# EAGLE design Full System 2.0 (EAGLE 8.6.0)
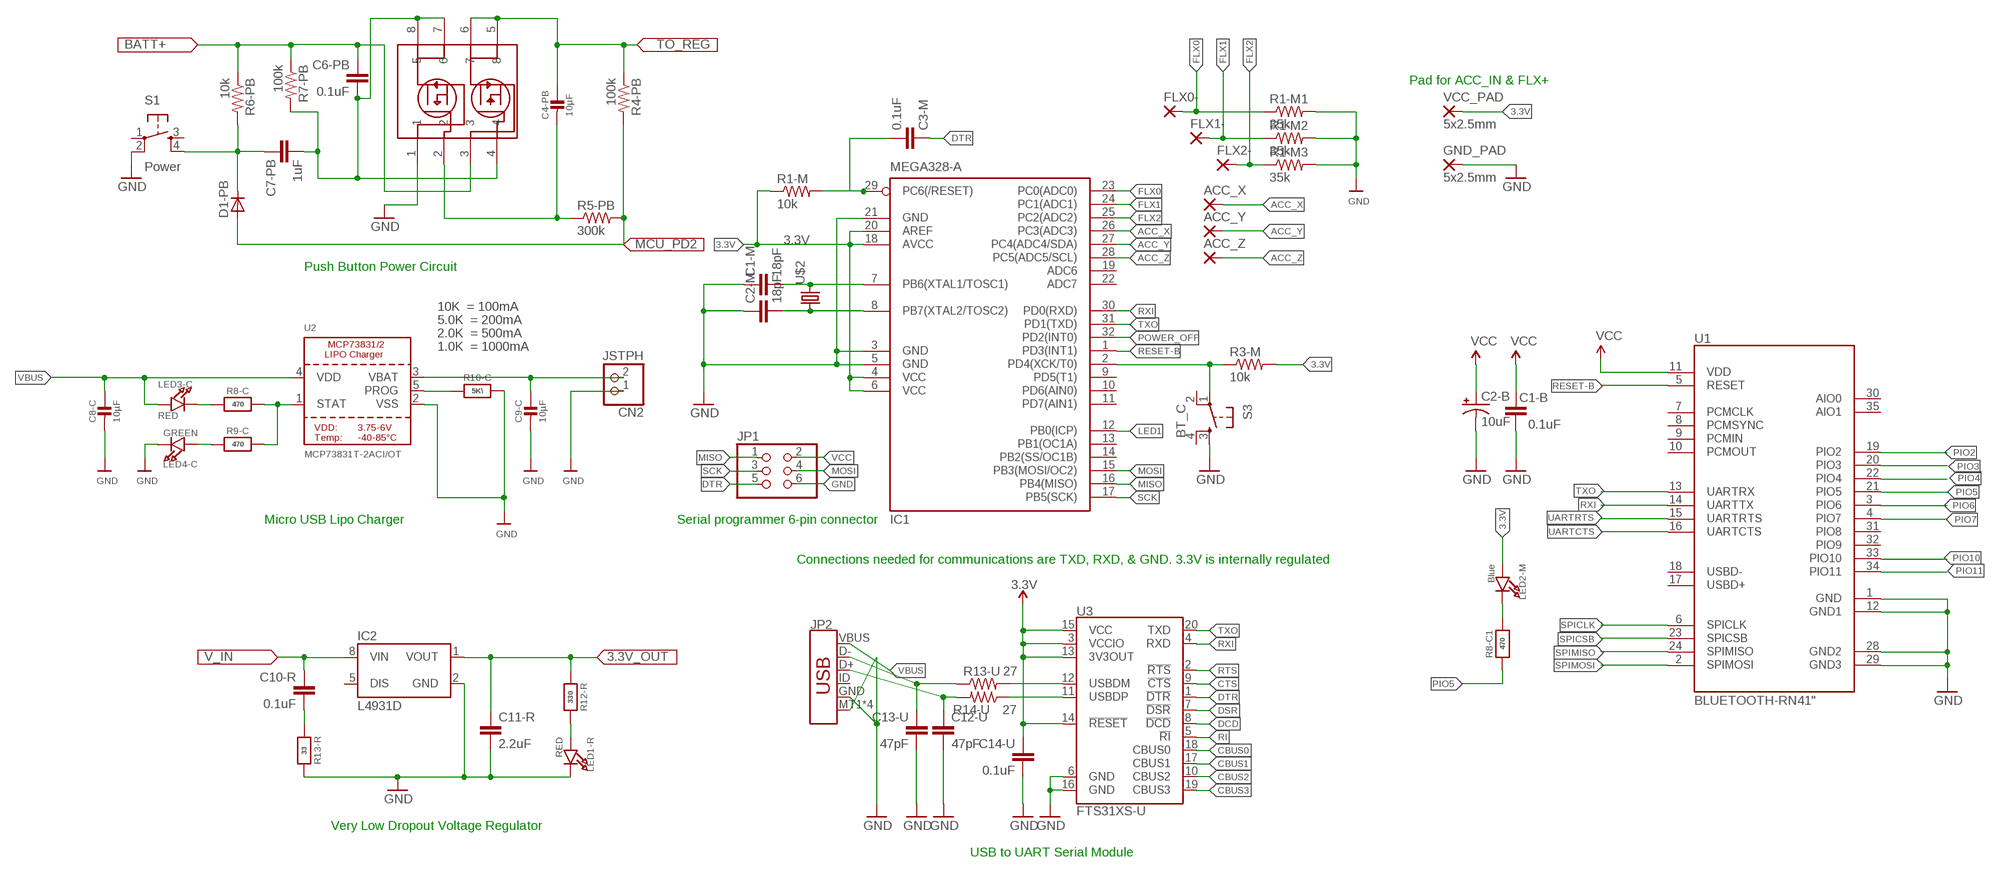
[diagram p0: schematic, sheet 1]

## Parts
ACC_X  1,6/0,8  [1,6/0,8]
ACC_Y  1,6/0,8  [1,6/0,8]
ACC_Z  1,6/0,8  [1,6/0,8]
C1-B  0.1uF  0.1UF-25V(+80/-20%)(0603)  [0603-CAP]
C1-M  18pF  C-EUC0603  [C0603]
C2-B  10uF  CAP_POL1206  [EIA3216]
C2-M  18pF  C-EUC0603  [C0603]
C3-M  0.1uF  0.1UF-25V(+80/-20%)(0603)  [0603-CAP]
C4-PB  10µF  CAP_CERAMIC0805-NOOUTLINE  [0805-NO]
C6-PB  0.1uF  0.1UF-25V(+80/-20%)(0603)  [0603-CAP]
C7-PB  1uF  0.1UF-25V(+80/-20%)(0603)  [0603-CAP]
C8-C  10µF  CAP_CERAMIC0805-NOOUTLINE  [0805-NO]
C9-C  10µF  CAP_CERAMIC0805-NOOUTLINE  [0805-NO]
C10-R  0.1uF  0.1UF-25V(+80/-20%)(0603)  [0603-CAP]
C11-R  2.2uF  0.1UF-25V(+80/-20%)(0603)  [0603-CAP]
C12-U  47pF  47PF-50V-5%(0603)  [0603-CAP]
C13-U  47pF  47PF-50V-5%(0603)  [0603-CAP]
C14-U  0.1uF  0.1UF-25V(+80/-20%)(0603)  [0603-CAP]
CN2  JSTPH  JST_2PIN  [JSTPH2]
D1-PB  D-A1-C3  [SOT23]
FLX0-  1,6/0,8  [1,6/0,8]
FLX1-  1,6/0,8  [1,6/0,8]
FLX2-  1,6/0,8  [1,6/0,8]
GND_PAD  5x2.5mm  WIREPADSMD5-2,5  [5-2,5]
IC1  MEGA328-A  MEGA8-AI  [TQFP32-08]
IC2  L4931D  [SO08]
JP1  PINHD-2X3  [2X03]
JP2  USB_MICRO-B_SMT  [USB-MICROB]
LED1-R  RED  LED0805_NOOUTLINE  [CHIPLED_0805_NOOUTLINE]
LED2-M  Blue  LED0805_NOOUTLINE  [CHIPLED_0805_NOOUTLINE]
LED3-C  RED  LED0805_NOOUTLINE  [CHIPLED_0805_NOOUTLINE]
LED4-C  GREEN  LED0805_NOOUTLINE  [CHIPLED_0805_NOOUTLINE]
R1-M  10k  R-US_R0805  [R0805]
R1-M1  35k  R-US_R0805  [R0805]
R1-M2  35k  R-US_R0805  [R0805]
R1-M3  35k  R-US_R0805  [R0805]
R3-M  10k  R-US_R0805  [R0805]
R4-PB  100k  R-US_R0805  [R0805]
R5-PB  300k  R-US_R0805  [R0805]
R6-PB  10k  R-US_R0805  [R0805]
R7-PB  100k  R-US_R0805  [R0805]
R8-C  470  RESISTOR0805_NOOUTLINE  [0805-NO]
R8-C1  470  RESISTOR0805_NOOUTLINE  [0805-NO]
R9-C  470  RESISTOR0805_NOOUTLINE  [0805-NO]
R10-C  5K\  RESISTOR0805_NOOUTLINE  [0805-NO]
R12-R  330  RESISTOR0805_NOOUTLINE  [0805-NO]
R13-R  33  RESISTOR0805_NOOUTLINE  [0805-NO]
R13-U  27  27OHM1/10W1%(0603)0603-RES  [0603-RES]
R14-U  27  27OHM1/10W1%(0603)0603-RES  [0603-RES]
S1  Power  TAC_SWITCHSMD  [TACTILE_SWITCH_SMD]
S3  BT_C  TAC_SWITCHSMD  [TACTILE_SWITCH_SMD]
U1  BLUETOOTH-RN41"  [RN41]
U2  MCP73831T-2ACI/OT  MCP73831/2  [SOT23-5]
U3  FTS31XS-U  FT231XS  [SSOP20_L]
U$2  CRYSTAL  [CRYSTAL]
U$8  IRF7319PBF  [IRF7319PBF]
VCC_PAD  5x2.5mm  WIREPADSMD5-2,5  [5-2,5]

## Nets
3.3V [power]: C1-B.1 C2-B.A(+) C11-R.1 C14-U.1 IC1.4(VCC) IC1.6(VCC) IC1.18(AVCC) IC1.20(AREF) IC2.1(VOUT) LED2-M.A R1-M.1 R3-M.2 R12-R.1 U1.11(VDD) U3.3(VCCIO) U3.13(3V3OUT) U3.14(!RESET) U3.15(VCC) VCC_PAD.1(P) ; supply symbol labelled VCC
ACC_X: ACC_X.1(P) IC1.26(PC3(ADC3))
ACC_Y: ACC_Y.1(P) IC1.27(PC4(ADC4/SDA))
ACC_Z: ACC_Z.1(P) IC1.28(PC5(ADC5/SCL))
CBUS0: U3.18(CBUS0)
CBUS3: U3.19(CBUS3)
CTS: U3.9(!CTS)
DCD: U3.8(!DCD)
DSR: U3.7(!DSR)
DTR: C3-M.1 JP1.5 U3.1(!DTR)
FLX0: FLX0-.1(P) IC1.23(PC0(ADC0)) R1-M1.1
FLX1: FLX1-.1(P) IC1.24(PC1(ADC1)) R1-M2.1
FLX2: FLX2-.1(P) IC1.25(PC2(ADC2)) R1-M3.1
GND: C1-B.2 C1-M.1 C2-B.C(-) C2-M.1 C8-C.2 C9-C.2 C11-R.2 C12-U.2 C13-U.2 C14-U.2 CN2.1 GND_PAD.1(P) IC1.3(GND) IC1.5(GND) IC1.21(GND) IC2.2(GND) JP1.6 JP2.GND JP2.MT1(SHIELD) JP2.MT2(SHIELD) JP2.P$1(SHIELD) JP2.P$2(SHIELD) LED1-R.C LED4-C.C R1-M1.2 R1-M2.2 R1-M3.2 R10-C.2 R13-R.2 S1.2 S3.3 U1.1(GND) U1.12(GND1) U1.28(GND2) U1.29(GND3) U2.2(VSS) U3.6(GND) U3.16(GND) U$8.1
LED1 [power]: IC1.12(PB0(ICP))
MISO: IC1.16(PB4(MISO)) JP1.1
MOSI: IC1.15(PB3(MOSI/OC2)) JP1.4
N$1: R13-U.2 U3.12(USBDM)
N$2: C1-M.2 IC1.7(PB6(XTAL1/TOSC1)) U$2.P$2
N$3: C2-M.2 IC1.8(PB7(XTAL2/TOSC2)) U$2.P$1
N$4: C6-PB.2 C7-PB.2 R7-PB.2 U$8.4 U$8.7 U$8.8
N$5: C7-PB.1 D1-PB.3(C) R6-PB.2 S1.4
N$6: IC1.2(PD4(XCK/T0)) R3-M.1 S3.1
N$7: LED1-R.A R12-R.2
N$8: C10-R.2 R13-R.1
N$9: C4-PB.2 R5-PB.1 U$8.2
N$10: LED2-M.C R8-C1.2
N$11: R14-U.1 U3.11(USBDP)
N$12: C12-U.1 JP2.D+ R14-U.2
N$16: LED3-C.C R8-C.1
N$17: R8-C.2 R9-C.2 U2.1(STAT)
N$18: R10-C.1 U2.5(PROG)
N$19: LED4-C.A R9-C.1
N$21: C13-U.1 JP2.D- R13-U.1
N$22: U3.17(CBUS1)
N$23: U3.10(CBUS2)
PIO2: U1.19(PIO2)
PIO3: U1.20(PIO3)
PIO4: U1.22(PIO4)
PIO5: R8-C1.1 U1.21(PIO5)
PIO6: U1.3(PIO6)
PIO7: U1.4(PIO7)
PIO10: U1.33(PIO10)
PIO11: U1.34(PIO11)
POWER_OFF [power]: D1-PB.1(A) IC1.32(PD2(INT0)) R4-PB.2 R5-PB.2
RESET: C3-M.2 IC1.29(PC6(/RESET)) R1-M.2
RESET-B: IC1.1(PD3(INT1)) U1.5(RESET)
RI: U3.5(!RI)
RTS: U3.2(!RTS)
RXI: IC1.30(PD0(RXD)) U1.14(UARTTX) U3.4(RXD)
SCK: IC1.17(PB5(SCK)) JP1.3
SPICLK: U1.6(SPICLK)
SPICSB: U1.23(SPICSB)
SPIMISO: U1.24(SPIMISO)
SPIMOSI: U1.2(SPIMOSI)
TXO: IC1.31(PD1(TXD)) U1.13(UARTRX) U3.20(TXD)
UARTCTS: U1.16(UARTCTS)
UARTRTS: U1.15(UARTRTS)
V_IN: C4-PB.1 C10-R.1 IC2.8(VIN) R4-PB.1 U$8.5 U$8.6
VBAT: C6-PB.1 C9-C.1 CN2.2 R6-PB.1 R7-PB.1 U2.3(VBAT) U$8.3
VBUS: C8-C.1 JP2.VBUS LED3-C.A U2.4(VDD)
VCC: JP1.2
Unconnected: IC1.9(PD5(T1)) IC1.10(PD6(AIN0)) IC1.11(PD7(AIN1)) IC1.13(PB1(OC1A)) IC1.14(PB2(SS/OC1B)) IC1.19(ADC6) IC1.22(ADC7) IC2.5(DIS) JP2.ID S1.1 S1.3 S3.2 S3.4 U1.7(PCMCLK) U1.8(PCMSYNC) U1.9(PCMIN) U1.10(PCMOUT) U1.17(USBD+) U1.18(USBD-) U1.30(AIO0) U1.31(PIO8) U1.32(PIO9) U1.35(AIO1)

## Notes on the sheet
- Pad for ACC_IN & FLX+
- Push Button Power Circuit
- 10K  = 100mA
- 5.0K  = 200mA
- 2.0K  = 500mA
- 1.0K  = 1000mA
- Micro USB Lipo Charger | Serial programmer 6-pin connector
- Connections needed for communications are TXD, RXD, & GND. 3.3V is internally regulated
- Very Low Dropout Voltage Regulator
- USB to UART Serial Module

## Library data of the parts
ACC_X ACC_Y ACC_Z FLX0- FLX1- FLX2- = wirepad:1,6/0,8: THROUGH-HOLE PAD
C1-B C3-M C6-PB C10-R C14-U = SparkFun-Capacitors:0.1UF-25V(+80/-20%)(0603): CAP-00810 Ceramic Standard decoupling cap; PROD_ID: CAP-00810
C1-M C2-M = rcl:C-EU: CAPACITOR, European symbol; SPICEPREFIX: C
C2-B = SparkFun:CAP_POL: Capacitor Polarized These are standard SMD and PTH capacitors. Normally 10uF, 47uF, and 100uF in electrolytic and tantalum varieties. Always verify the external diameter of the through hole cap, it varies with capacity, voltage, and manufacturer. The EIA devices should be standard.
C4-PB C8-C C9-C = microbuilder:CAP_CERAMIC: Ceramic Capacitors For new designs, use the packages preceded by an '_' character since they are more reliable: The following footprints should be used on most boards: _0402 - Standard footprint for regular board layouts _0603 - Standard footprint for regular board layouts _0805 - Standard footprint for regular board layouts _1206 - Standard footprint for regular board layouts For extremely tight-pitch boards where space is at a premium, the following 'micro-pitch' footprints can be used (smaller pads, no silkscreen outline, etc.): _0402MP - Micro-pitch footprint for very dense/compact boards _0603MP - Micro-pitch footprint for very dense/compact boards _0805MP - Micro-pitch footprint for very dense/compact boards _1206MP - Micro-pitch footprint for very dense/compact boards
C7-PB C11-R = SparkFun-Capacitors:0.1UF-25V(+80/-20%)(0603): CAP-00810 Ceramic Standard decoupling cap; PROD_ID: CAP-00810; VALUE: 0.1uF
C12-U C13-U = SparkFun-Capacitors:47PF-50V-5%(0603): CAP-08913; PROD_ID: CAP-08913
CN2 = microbuilder:JST_2PIN: JST 2-Pin Right-Angle Connector PH-Series - 4UConnector: 17311 SH-Series - 4UConnector: 07278
D1-PB = semicon-smd-ipc:D-: DIODE unfilled
GND_PAD VCC_PAD = wirepad:WIREPAD: Wire PAD connect wire on PCB
IC1 = atmel:MEGA8: MICROCONTROLLER 8 Kbytes FLASH, 1 kbytes SRAM, 512 bytes EEPROM, USART, 6-channel 10 bit ADC, 2-channel 8 bit ADC Pin compatible with Atmega48, ATMega88, ATMega168 Source: avr.lbr; MPN: ATMEGA8-16AU; OC_FARNELL: 9171371; OC_NEWARK: 73M8863
IC2 = v-reg-3:L4931: STMicroelectronics <http://www.st.com> 250mA low dropout voltage regulator Vin 5V to 28V (transients 40V), disable pin, 50µA shutdown current
JP1 = pinhead:PINHD-2X3: PIN HEADER
JP2 = SparkFun-Connectors:USB_MICRO-B: USB Type Micro-B Connector Male/female and PTH/SMT variants SparkFun Products: SparkFun microB USB Breakout <https://www.sparkfun.com/products/12035> SparkFun USB microB Plug Breakout <https://www.sparkfun.com/products/10031> SparkFun ESP8266 Thing <https://www.sparkfun.com/products/13231>; PROD_ID: CONN-09505; SF_ID: PRT-08533
LED1-R LED2-M LED3-C LED4-C = microbuilder:LED: LED 0603 - 0603 Surface Mount Package 2mA: Green LED - Low Power (3.9mcd, 2ma, 1.7Vf) - Digikey: 475-2709-2-ND Orange LED - Low Power (9.8mcd, 2ma, 1.8Vf) - Digikey: 475-1194-2-ND Red LED - Low Power (5mcd, 2ma, 1.8Vf) - Digikey: 475-1195-2-ND Yellow LED - Low Power (7mcd, 2ma, 1.8Vf) - Digikey: 475-1196-2-ND 5mA: Blue LED - Low Power (17mcd, 5ma, 2.9Vf) - Digikey: LNJ937W8CRACT-ND 0805 - 0805 Surface Mount Package 2mA: Red LED (8.8mcd, 2mA, 1.8Vf, Clear) - Low Power [Digikey: 475-2510-1-ND] Green LED (5mcd, 2mA, 1.8Vf, Clear) - Low Power [Digikey: 475-2730-1-ND] Yellow LED (11.3mcd, 2mA, 1.8Vf, Clear) - Low Power [Digikey: 475-2555-1-ND] 20mA: Red LED (104mcd, 20mA, Diffused) - LS R976 [Digikey: 475-1278-6-ND] Red LED (12mcd, 20mA, 2.0Vf, Clear) - APT2012EC [Digikey: 754-1128-1-ND] Green LED (15mcd, 20mA, 2.2Vf, Clear) - APT2012GC [Digikey: 754-1131-1-ND] Orange LED (160mcd, 20mA, 2.1Vf, Clear) - APT2012SECK [Digikey: 754-1130-1-ND] 1206 - 1206 Surface Mount Package Green LED (26mcd, 20mA, Diffused) - LG N971 [Digikey: 475-1407-6-ND] Red LED (15mcd, 20mA, Diffused) - LH N974 [Digikey: 475-1416-6-ND] Cree - Cree High-Power Surface Mount LEDs XPEBWT-L1-0000-00D50 - White 111lm 350mA 2.9Vf 6200K 110° XTEAWT-00-0000-00000LEE3 - White 114lm 350mA 2.85Vf 5000K 115° Everlight - Everlight 45-21 Series Surface Mount LEDs 45-21/QK2C-B2832AC2CB2/2T - Warm White 2000mcd 20mA 3.25Vf 3050K 120° 45-21/LK2C-B38452C4CB2/2T - Nuetral White 2000mcd 20mA 3.25Vf 4150K 120° 45-21/LK2C-B50634C6CB2/2T - Cold White 2200mcd 20mA 3.25Vf 5650K 120° PLCC2 Reverse Mount LS T77K-J1L2-1-0-2-R18-Z - Red 11.25mcd 2mA 1.8Vf 630nm 120° LO T77K-L1M2-24-Z - Orange 19.6mcd 2mA 1.8Vf 606nm 120° LY T77K-K2M1-26-Z - Yellow 15.7mcd 2mA 1.8Vf 587nm 120°
R1-M R1-M1-R1-M3 R3-M R4-PB R5-PB R6-PB R7-PB = rcl:R-US_: RESISTOR, American symbol; SPICEPREFIX: R
R8-C R8-C1 R9-C R10-C R12-R R13-R = microbuilder:RESISTOR: Resistors For new designs, use the packages preceded by an '_' character since they are more reliable: The following footprints should be used on most boards: _0402 - Standard footprint for regular board layouts _0603 - Standard footprint for regular board layouts _0805 - Standard footprint for regular board layouts _1206 - Standard footprint for regular board layouts For extremely tight-pitch boards where space is at a premium, the following 'micro-pitch' footprints can be used (smaller pads, no silkscreen outline, etc.): _0402MP - Micro-pitch footprint for very dense/compact boards _0603MP - Micro-pitch footprint for very dense/compact boards _0805MP - Micro-pitch footprint for very dense/compact boards _1206MP - Micro-pitch footprint for very dense/compact boards
R13-U R14-U = SparkFun-Resistors:27OHM1/10W1%(0603): RES-09334; PROD_ID: RES-09334
S1 S3 = Spark:TAC_SWITCH: SMD Tactiile Switch
U1 = SparkFun-RF:BLUETOOTH-RN41: Bluetooth SMD module
U2 = microbuilder:MCP73831/2: MCP73831/2 LIPO Charger VDD: 3.75 - 6V Temp -40 - 85°C Programmable Charge Rate: 15-500mA NOTE: STAT is a tri-state logic output on the MCP73831 and an open-drain output on the MCP73832. SOT23-5 with 4.2V output and tri-state logic on STAT = MCP73831T-2ACI/OT
U3 = SparkFun-DigitalIC:FT231X: FTDI FT231X Full Speed USB to Full-handshake UART This USB2.0 Full Speed IC offers a compact bridge to full handshake UART interfaces. The device is a UART, capable of operating up to 3MBaud, with low power consumption (8mA). The FT231X includes the complete FT-X series feature set and enables USB to be added into a system design quickly and easily over a UART interface.; PROD_ID: IC-11524
U$2 = Crystal:CRYSTAL: 8MHz Crystal 2 pin package
U$8 = IRF7319PbF:IRF7319PBF

## Net classes
0 default: width 0.203 mm
1 power: width 0.254 mm

## Board
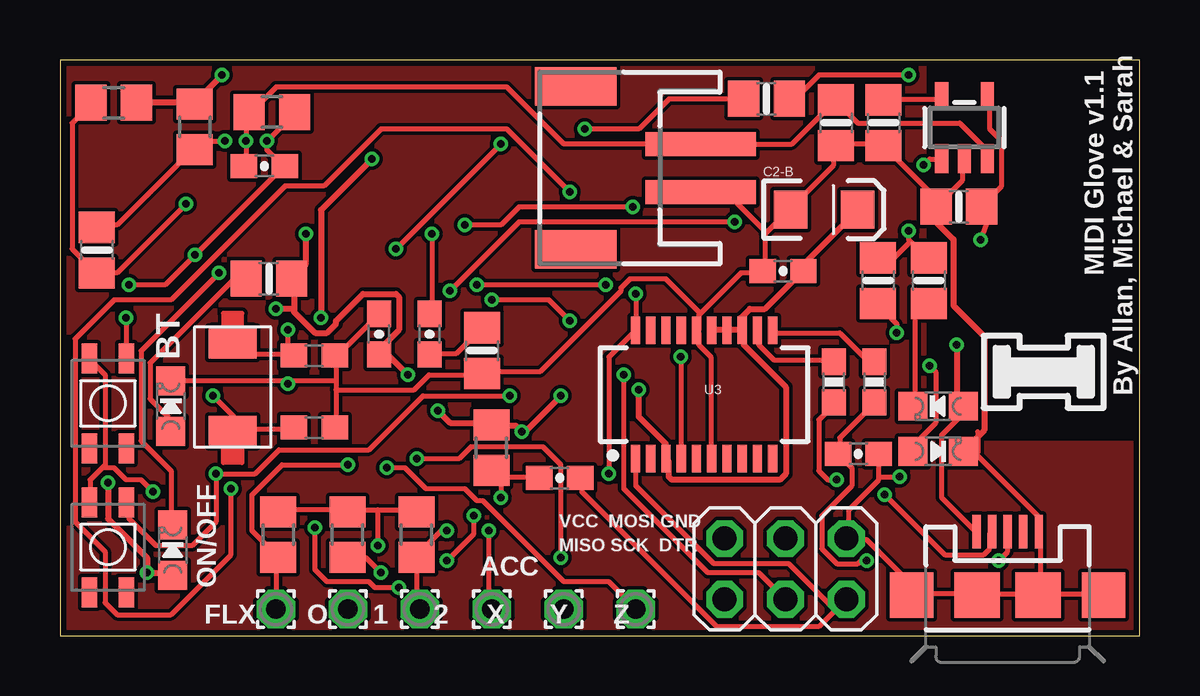
[diagram p1: board, top side]
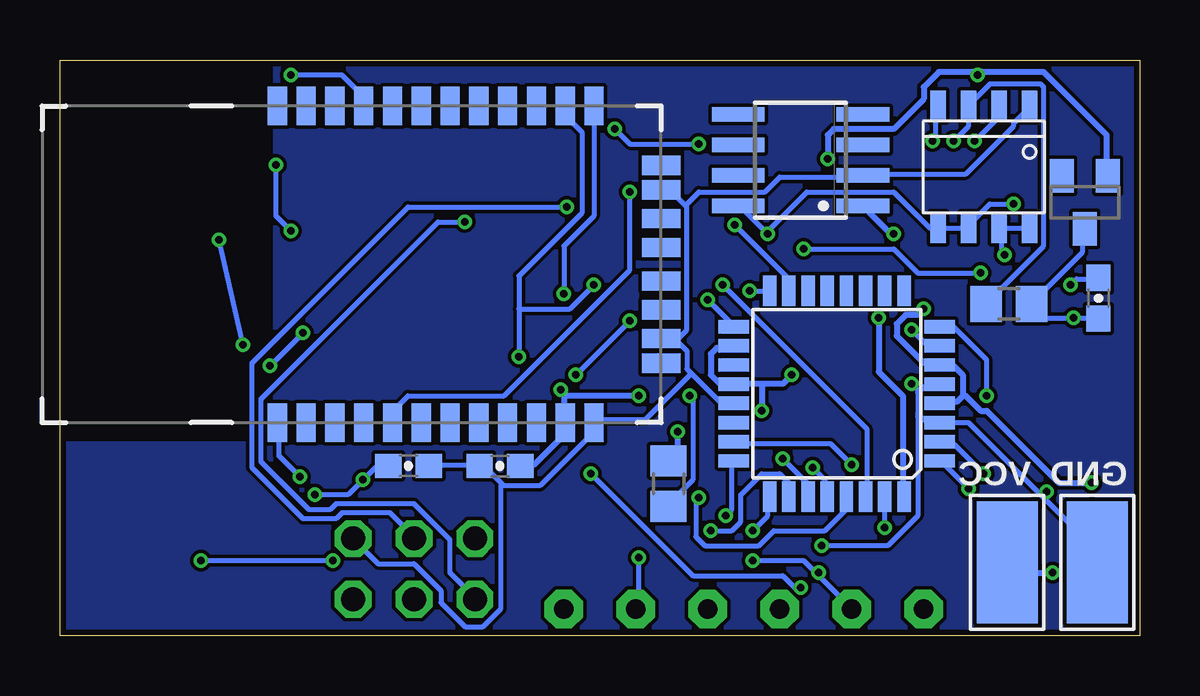
[diagram p2: board, bottom side, seen from below]

Size 45 x 24 mm. Coordinates in mm from the lower left corner, seen from the top.
Outline: 0,0 45,0 45,24 0,24 0,0
Copper layers (1*16): Top 0.035mm / dielectric 1.5mm / Bottom 0.035mm
Design rules "PCBWay_2layer": minimum track width 6mil, minimum drill 0.3mm, track to track 6mil, track to pad 6mil, pad to pad 6mil, via to via 6mil, smd to smd 4mil, copper to edge 10mil, drill to drill 6mil, minimum pad ring 6mil, minimum via ring 6mil, stop-mask expansion 4mil, vias tented up to drill 0.8mm, thermal gap 10mil
tKeepout: area 38.5,9 to 45,22

### Footprints (pad centres in the part's own frame; a part is rotated, then mirrored left to right if it is on the bottom)
1,6/0,8 = drill 0.813 pad 1.6 octagon: 1 0,0
0603-CAP = smd 1.1 x 1: 1 -0.85,0; 2 0.85,0
C0603 = smd 1.1 x 1: 1 -0.85,0; 2 0.85,0
EIA3216 = smd 1.4 x 1.6: A 1.4,0; C -1.4,0
0805-NO = smd 1.3 x 1.5: 1 -0.95,0; 2 0.95,0
JSTPH2 = smd 1 x 4.6: 1 -1,-3.7; 2 1,-3.7 | smd 1.6 x 3.4: NC1 -3.4,1.5; NC2 3.4,1.5
SOT23 = smd 1 x 1.4: 1 -0.95,-1.1; 2 0.95,-1.1; 3 0,1.1
5-2,5 = smd 2.54 x 5.08: 1 0,0
TQFP32-08 = smd 1.27 x 0.559: 1 -4.293,2.8; 2 -4.293,2; 3 -4.293,1.2; 4 -4.293,0.4; 5 -4.293,-0.4; 6 -4.293,-1.2; 7 -4.293,-2; 8 -4.293,-2.8; 17 4.293,-2.8; 18 4.293,-2; 19 4.293,-1.2; 20 4.293,-0.4; 21 4.293,0.4; 22 4.293,1.2; 23 4.293,2; 24 4.293,2.8 | smd 0.559 x 1.27: 9 -2.8,-4.293; 10 -2,-4.293; 11 -1.2,-4.293; 12 -0.4,-4.293; 13 0.4,-4.293; 14 1.2,-4.293; 15 2,-4.293; 16 2.8,-4.293; 25 2.8,4.293; 26 2,4.293; 27 1.2,4.293; 28 0.4,4.293; 29 -0.4,4.293; 30 -1.2,4.293; 31 -2,4.293; 32 -2.8,4.293
SO08 = smd 0.6 x 2.2: 1 -1.905,-2.6; 2 -0.635,-2.6; 3 0.635,-2.6; 4 1.905,-2.6; 5 1.905,2.6; 6 0.635,2.6; 7 -0.635,2.6; 8 -1.905,2.6
2X03 = drill 1.016 octagon: 1 -2.54,-1.27; 2 -2.54,1.27; 3 0,-1.27; 4 0,1.27; 5 2.54,-1.27; 6 2.54,1.27
USB-MICROB = smd 1.4 x 0.35: D+ -2.65,0; D- -2.65,-0.65; GND -2.65,1.3; ID -2.65,0.65; VBUS -2.65,-1.3 | smd 1.9 x 1.8: MT1 0,-4; MT2 0,4 | smd 1.9 x 1.9: P$1 0,-1.27; P$2 0,1.27
CHIPLED_0805_NOOUTLINE = smd 1.2 x 1.2: A 0,-1.05; C 0,1.05
R0805 = smd 1.3 x 1.5: 1 -0.95,0; 2 0.95,0
0603-RES = smd 1.1 x 1: 1 -0.85,0; 2 0.85,0
TACTILE_SWITCH_SMD = smd 1.25 x 0.65: 1 -1.875,0.775; 2 1.875,0.775; 3 -1.875,-0.775; 4 1.875,-0.775
RN41 = smd 0.8 x 1.6: 1 -6.6,-6.6; 2 -5.4,-6.6; 3 -4.2,-6.6; 4 -3,-6.6; 5 -1.8,-6.6; 6 -0.6,-6.6; 7 0.6,-6.6; 8 1.8,-6.6; 9 3,-6.6; 10 4.2,-6.6; 11 5.4,-6.6; 12 6.6,-6.6; 13 6.6,6.6; 14 5.4,6.6; 15 4.2,6.6; 16 3,6.6; 17 1.8,6.6; 18 0.6,6.6; 19 -0.6,6.6; 20 -1.8,6.6; 21 -3,6.6; 22 -4.2,6.6; 23 -5.4,6.6; 24 -6.6,6.6 | smd 1.6 x 0.8: 28 9.4,3.1; 29 9.4,-3.1; 30 9.4,4.122; 31 9.4,1.9; 32 9.4,0.7; 33 9.4,-0.7; 34 9.4,-1.9; 35 9.4,-4.122
SOT23-5 = smd 0.55 x 1.2: 1 -0.95,-1.3; 2 0,-1.3; 3 0.95,-1.3; 4 0.95,1.3; 5 -0.95,1.3
SSOP20_L = smd 0.381 x 1.143: 1 -2.857,-2.68; 2 -2.223,-2.68; 3 -1.587,-2.68; 4 -0.953,-2.68; 5 -0.318,-2.68; 6 0.318,-2.68; 7 0.953,-2.68; 8 1.587,-2.68; 9 2.223,-2.68; 10 2.857,-2.68; 11 2.857,2.68; 12 2.223,2.68; 13 1.587,2.68; 14 0.953,2.68; 15 0.318,2.68; 16 -0.318,2.68; 17 -0.953,2.68; 18 -1.587,2.68; 19 -2.223,2.68; 20 -2.857,2.68
CRYSTAL = smd 1.3 x 2: P$1 -1.75,0; P$2 1.95,0
IRF7319PBF = smd 0.635 x 1.27: 1 0.635,-0.635; 2 1.905,-0.635; 3 3.175,-0.635; 4 4.445,-0.635; 5 4.445,4.445; 6 3.175,4.445; 7 1.905,4.445; 8 0.635,4.445

### Placement (x,y rotation side)
ACC_X  18,1.1 0 top
ACC_Y  21,1.1 0 top
ACC_Z  24,1.1 0 top
C1-B  30.14,15.2 180 top
C1-M  10.6,11.68 180 top
C2-B  31.85,17.76 0 top
C2-M  10.6,8.68 180 top
C3-M  20.83,6.57 180 top
C4-PB  1.54,16.07 90 top
C6-PB  8.52,19.57 0 top
C7-PB  1.71,14.07 90 bottom
C8-C  37.47,17.88 180 top
C9-C  32.35,21.38 270 top
C10-R  15.4,12.57 270 top
C11-R  13.3,12.57 90 top
C12-U  33.28,7.57 0 top
C13-U  30.47,7.07 0 bottom
C14-U  26.66,7.07 180 bottom
CN2  23,19.5 90 top
D1-PB  2.28,18.06 180 bottom
FLX0-  9,1.1 0 top
FLX1-  12,1.1 0 top
FLX2-  15,1.1 0 top
GND_PAD  1.76,3.05 180 bottom
IC1  12.62,10.08 180 bottom
IC2  14.13,19.82 90 bottom
JP1  30.24,2.78 0 top
JP2  39.5,1.69 270 top
LED1-R  4.62,9.56 0 top
LED2-M  4.7,3.56 0 top
LED3-C  36.6,9.56 90 top
LED4-C  36.6,7.68 270 top
R1-M  17.98,7.83 270 top
R1-M1  9.1,4.21 90 top
R1-M2  11.98,4.21 90 top
R1-M3  14.86,4.21 90 top
R3-M  19.63,6.33 90 bottom
R4-PB  2.24,22.21 0 top
R5-PB  5.62,21.21 90 top
R6-PB  5.45,13.83 0 bottom
R7-PB  8.83,21.83 0 top
R8-C  36.22,14.8 90 top
R8-C1  29.45,22.38 180 top
R9-C  34.1,14.8 90 top
R10-C  34.33,21.38 270 top
R12-R  8.71,14.88 180 top
R13-R  17.59,11.88 270 top
R13-U  32.26,10.57 90 top
R14-U  33.95,10.57 270 top
S1  2,9.68 90 top
S3  2,3.68 270 top
U1  29.34,15.48 0 bottom
U2  37.7,21.18 0 top
U3  26.85,10.05 0 top
U$2  7.2,10.26 90 top
U$8  3.95,21.44 180 bottom
VCC_PAD  5.52,3.05 180 bottom

### Tracks (layer width: path | path; a pad name or v marks a point on that pad's centre or on a via)
3.3V  (via drill 0.3)
  Top 0.254: C2-B.A 31,15.5 31,15.25 C1-B.1 30.88,15.12 29.38,13.62 28.75,13.62 28.38,13.25 28.38,12.88 U3.13 | U3.15 27.25,12.75 27.75,12.75 U3.14 27.88,12.75 28.38,12.75 U3.13 | U3.13 28.5,12.62 28.5,12.12 30.25,10.38 30.25,6.75 30,6.5 25.5,6.5 25.38,6.62 25.38,7.25 U3.3 25.25,8 24.12,9.12 v24.12,10.25 | LED2-M.A 4.62,2.62 v3.62,2.62 3.62,3.25 2,4.88 v2,6.38 | 9.75,13.62 9.75,14.88 R12-R.1 9.75,15 10.25,15.5 v10.25,16.75 | 9.75,13.62 9.75,13.5 10.62,12.62 11.12,12.62 11.5,13 11.5,13.12 12.62,14.25 14,14.25 14.12,14.12 14.12,12.75 13.38,12 13.38,11.75 C11-R.1 13.5,11.88 v14.5,10.88 | 9.75,13.62 v9,13.62 | v15.75,9.38 16.25,8.88 17.88,8.88 R1-M.1 18,8.75 19,8.75 v19.25,8.5 19.38,8.5 v20.88,10
  Bottom 0.254: C14-U.1 25.75,7.12 25.25,7.12 24,8.38 24,8.88 U1.11 24,9 24,10 | 24,10 24,10.12 v24.12,10.25 | v3.62,2.62 5.12,2.62 5.5,3 VCC_PAD.1 | v19.25,8.5 19.25,7.75 19.62,7.38 R3-M.2 | IC1.18 17,12 17.62,12 17.88,11.75 17.88,10.88 17.5,10.5 17,10.5 IC1.20 16.88,10.5 15.75,10.5 | 7.38,10 7.62,9.75 8.25,9.75 IC1.4 | 7.38,10 7.38,10.88 7.75,11.25 8.25,11.25 IC1.6 8.38,11.38 9,11.38 10.12,12.5 10.12,13 9.75,13.38 9.25,13.38 v9,13.62 | 15.75,10.5 14.88,10.5 v14.5,10.88 | v10.25,16.75 10.38,16.75 11.5,17.88 IC2.1 | 15.75,10.5 v15.75,9.38 | v2,6.38 3.38,6.38 6.38,9.38 6.62,9.38 7.25,10 7.38,10 | v20.88,10 24,10
ACC_X  (via drill 0.3)
  Top 0.203: v17.88,4.38 17.88,1.25 18,1.12 ACC_X.1
  Bottom 0.203: v17.88,4.38 17,4.38 16.62,4.75 16.62,5.88 15.75,6.75 15,6.75 14.62,6.38 14.62,5.88 IC1.26
ACC_Y  (via drill 0.3)
  Top 0.203: v14.88,7.38 16.62,7.38 17.12,7.88 20.12,7.88 20.88,7.12 v20.88,3.25
  Bottom 0.203: v14.88,7.38 13.88,6.38 13.88,5.88 IC1.27 | v20.88,3.25 20.88,1.25 21,1.12 ACC_Y.1
ACC_Z  (via drill 0.3)
  Top 0.203: v13.62,7 14.38,7 15.25,6.12 16.88,6.12 17.38,5.62 17.62,5.62 21,2.25 22.88,2.25 24,1.12 ACC_Z.1
  Bottom 0.203: v13.62,7 13.12,6.5 13.12,5.88 IC1.28
DTR
  Top 0.203: C3-M.1 21.75,6.5 21.75,6 27.38,0.38 31.62,0.38 32.75,1.5 JP1.5 32.25,1.12 30.38,3 27.25,3 24,6.25 24,7.25 U3.1
FLX0  (via drill 0.3)
  Top 0.203: v12,7.12 9.25,7.12 8,5.88 8,4.38 9,3.38 R1-M1.1 9,3.25 FLX0-.1
  Bottom 0.203: v12,7.12 12.88,8 16.88,8 IC1.23
FLX1  (via drill 0.3)
  Top 0.203: v17.25,5 17.25,4.25 v16.12,3.12 | v13.38,2.62 12.75,3.25 12,3.25 R1-M2.1
  Bottom 0.203: v17.25,5 17,5.25 17,7.25 IC1.24 | v16.12,3.12 14,3.12 13.44,2.56 | 13.44,2.56 12,1.12 FLX1-.1 | v13.38,2.62 13.44,2.56
FLX2  (via drill 0.3)
  Top 0.203: v16.12,4.38 15.88,4.38 14.88,3.38 R1-M3.1 14.88,3.25 14.88,1.25 15,1.12 FLX2-.1
  Bottom 0.203: v16.12,4.38 15.5,5 15.5,5.75 IC1.25
GND  (via drill 0.3)
  Top 0.203: R1-M1.2 9.12,5.25 11.88,5.25 R1-M2.2 12,5.25 13.25,5.25 | 13.25,5.25 14.75,5.25 R1-M3.2 | 1.81,7.06 1.88,7.12 1.88,10.88 1.25,11.5 S1.2 | 1.81,7.06 1.25,6.5 1.25,5.62 S3.3 | v3.88,6 3.38,6.5 2.75,6.5 2.25,7 1.88,7 1.81,7.06 | v13.25,3.75 13.25,5.25 | 34.12,6.62 34.12,6.5 32.88,5.25 32.88,4.12 JP1.6 32.88,4 33.62,4 35.5,2.12 35.5,1.75 | 34.12,6.62 34.12,7.5 C12-U.2 | 34.12,6.62 v35,6.62 | 38.19,7.56 40.75,5 40.75,4.38 JP2.GND 40.88,4.25 40.88,1.75 | 38.19,7.56 38.12,7.62 37.75,7.62 LED4-C.C | 35.5,1.75 38.12,1.75 JP2.P$1 38.25,1.75 40.75,1.75 JP2.P$2 40.88,1.75 | 40.88,1.75 43.5,1.75 JP2.MT2 | 35.5,1.75 JP2.MT1 | 11.5,11.62 11.5,10.62 | 11.5,10.62 11.5,10.25 | 11.5,10.25 11.5,8.75 C2-M.1 | 11.5,11.62 13.25,13.38 C11-R.2 | 11.5,11.62 C1-M.1 | 11.5,10.62 9.5,10.62 | 9.5,10.62 4.62,10.62 LED1-R.C | 11.5,10.25 14.75,10.25 15.38,10.88 17.5,10.88 R13-R.2 17.62,11 20,11 23.38,14.38 23.38,14.5 23.75,14.88 25.25,14.88 26.69,13.44 | U2.2 37.62,19.88 37.62,19 36.62,18 C8-C.2 | C8-C.2 36.62,18.12 34.38,20.38 R10-C.2 34.25,20.5 32.38,20.5 C9-C.2 32.25,20.38 32.25,19.62 30.5,17.88 C2-B.C 30.38,17.75 29.44,16.81 | 29.44,16.81 29.38,16.75 29.38,15.25 C1-B.2 29.25,15.12 28.38,15.12 26.69,13.44 | 26.69,13.44 26.62,13.38 26.62,12.75 U3.16 26.62,12.62 26.62,12.12 27.12,11.62 27.12,7.38 U3.6 | CN2.1 27.75,18.5 29.44,16.81 | 38.25,8.5 38.25,7.62 38.19,7.56 | 36.62,17.38 36.62,17.88 C8-C.2 | 9.5,10.62 v9.5,10.5
  Top 0.254: C8-C.2 36.52,17.25 37.25,16.52 37.25,13.75 38.53,12.47 38.53,8.56 LED4-C.C
  Bottom 0.203: U$8.1 4.62,22 5.25,21.38 5.25,21.25 7.25,19.25 11.5,19.25 IC2.2 11.62,19.12 15,19.12 15.62,18.5 18.38,18.5 18.94,17.94 | C13-U.2 29.5,7.12 27.62,7.12 C14-U.2 27.5,7 27.25,7 26.56,6.31 | 18.69,10.94 18.88,11.12 18.88,11.88 19.38,12.38 19.88,12.38 U1.29 19.25,12.38 18.88,12.75 18.88,17.88 18.94,17.94 | 18.69,10.94 17.5,9.75 17,9.75 IC1.21 | 18.69,10.94 20.62,9 22.62,9 U1.12 22.75,8.5 25,6.25 26.5,6.25 26.56,6.31 | 18.94,17.94 19.5,18.5 19.88,18.5 U1.28 | 9.19,9.19 9.25,9.25 9.25,10.12 9.19,10.19 | 9.19,9.19 9,9 8.38,9 IC1.3 8.25,8.88 7.12,8.88 4.06,5.81 | 9.19,10.19 9,10.38 8.38,10.38 IC1.5 | 4.06,5.81 1.88,3.62 1.88,3.12 GND_PAD.1 | 4.06,5.81 v3.88,6 | v13.25,3.75 10.5,3.75 9.25,5 9.25,9.12 9.19,9.19 | v35,6.62 35.88,7.5 35.88,8.88 U1.1 | v9.5,10.5 9.19,10.19 | 26.56,6.31 26.62,6.25 26.62,1.12 27.38,0.38 28.12,0.38 29.12,1.38 29.12,1.88 30.25,3 31.75,3 32.75,4 JP1.6
MISO  (via drill 0.3)
  Top 0.203: v16.25,14.38 19.12,17.25 v28.12,17.25
  Bottom 0.203: v16.25,14.38 15.5,14.38 IC1.16 | v28.12,17.25 29.25,17.25 36.62,9.88 36.62,7.25 34.62,5.25 33.75,5.25 33.5,5.5 30.25,5.5 28.75,4 28.75,2.62 27.75,1.62 JP1.1
MOSI  (via drill 0.3)
  Top 0.203: v16.88,17.12 18.38,17.12 19.12,17.88 v23.88,17.88
  Bottom 0.203: v16.88,17.12 14.62,14.88 IC1.15 | v23.88,17.88 30.5,17.88 37,11.38 37,7 34.88,4.88 33.5,4.88 33.25,5.12 31.25,5.12 30.25,4.12 JP1.4
N$1
  Top 0.203: R13-U.2 32.25,11.5 29.75,11.5 29.12,12.12 29.12,12.62 U3.12
N$2  (via drill 0.3)
  Top 0.203: 9.5,11.75 8.12,11.75 7.75,12.12 U$2.P$2 | 9.5,11.75 9.75,11.75 C1-M.2 9.5,11.75 | 9.5,11.75 v9.5,12.75
  Bottom 0.203: v9.5,12.75 8.88,12.12 8.38,12.12 IC1.7
N$3  (via drill 0.3)
  Top 0.203: 7.75,8.62 9.75,8.62 C2-M.2 | 7.75,8.62 v6.38,10 | 7.75,8.62 U$2.P$1
  Bottom 0.203: v6.38,10 6.38,11.5 7.75,12.88 8.25,12.88 IC1.8
N$4  (via drill 0.3)
  Top 0.203: v2.88,14.62 4.38,14.62 v5.62,15.88 9.25,19.5 C6-PB.2 9.25,19.62 8.62,20.25 v8.62,20.62 9.75,21.75 R7-PB.2
  Bottom 0.203: U$8.8 4.62,17 5.75,17 U$8.7 5.75,16.88 5.75,16 v5.62,15.88 | v2.88,14.62 2.62,14.88 1.75,14.88 C7-PB.2 | v8.62,20.62 8.5,20.75 8.5,22 U$8.4
N$5  (via drill 0.3)
  Top 0.203: v2.75,13.25 2.75,11.62 S1.4
  Bottom 0.203: C7-PB.1 1.75,13.25 v2.75,13.25 4,13.25 4.5,13.75 R6-PB.2 4.5,13.88 2.38,16 2.38,16.88 D1-PB.3
N$6  (via drill 0.3)
  Top 0.203: S3.1 2.88,5.5 2.88,4.88 4,3.75 5.5,3.75 6.5,4.75 v6.5,6.75 8.12,6.75 9.12,7.75 12.88,7.75 15.12,10 v18.75,10
  Bottom 0.203: v6.5,6.75 7.75,8 8.25,8 IC1.2 | v18.75,10 18.62,9.88 18.62,6.5 19.62,5.5 R3-M.1
N$7
  Top 0.203: LED1-R.A 4.5,8.62 4.5,9.12 3.75,9.88 3.75,11.38 7.25,14.88 R12-R.2
N$8
  Top 0.203: C10-R.2 15.5,11.75 16.5,11.75 17.5,12.75 R13-R.1
N$9  (via drill 0.3)
  Top 0.203: v6.88,20.62 5.88,20.62 5.62,20.38 R5-PB.1 5.5,20.25 2.38,17.12 1.62,17.12 C4-PB.2
  Bottom 0.203: v6.88,20.62 5.88,21.62 5.88,22 U$8.2
N$10  (via drill 0.3)
  Top 0.203: v6.62,15.12 3.38,11.88 3.38,8.12 4.62,6.88 4.62,4.62 LED2-M.C | v18.38,20.5 v14,16.12 | v21.88,21.12 24.12,21.12 25.38,22.38 R8-C1.2
  Bottom 0.203: v6.62,15.12 9.25,15.12 10.25,16.12 v14,16.12 | v18.38,20.5 21.25,20.5 v21.88,21.12
N$11
  Top 0.203: R14-U.1 33.88,11.5 33.62,11.5 32.5,12.62 29.75,12.62 U3.11
N$12  (via drill 0.3)
  Top 0.203: R14-U.2 33.88,9.62 32.5,8.25 32.5,7.62 C12-U.1 33,7 33,6.25 31.75,5 31.75,3.62 32.38,3 33.25,3 33.38,3.12 v33.62,3.12 | JP2.D+ 39.5,3.5 v39.12,3.12
  Bottom 0.203: v33.62,3.12 v39.12,3.12
N$13
  pour Top: 0,24 0,0 45,0 45,8 36,8 36,24
N$14
  pour Bottom: 0,24 0,0 45,0 45,8 36,8 36,24
N$16
  Top 0.203: LED3-C.C 35.62,9.62 35.62,13.25 36.12,13.75 R8-C.1
N$17  (via drill 0.3)
  Top 0.203: v36,19.62 36.25,19.88 U2.1 | v35.38,16.88 35.38,16.5 35.44,16.44 | 35.44,16.44 36.12,15.75 R8-C.2 | R9-C.2 34.75,15.75 35.44,16.44
  Bottom 0.203: v36,19.62 36,17.5 v35.38,16.88
N$18
  Top 0.203: U2.5 36.75,22.38 34.38,22.38 R10-C.1
N$19  (via drill 0.3)
  Top 0.203: v36.25,11.25 36.5,11 36.5,8.88 35.62,8 35.62,7.75 LED4-C.A | v34.88,12.62 34.88,13 34.12,13.75 R9-C.1
  Bottom 0.203: v34.88,12.62 v36.25,11.25
N$21  (via drill 0.3)
  Top 0.203: v32.38,6.5 32,6.5 31.62,6.88 31.62,9 32.25,9.62 R13-U.1 | v34.38,5.88 36.88,3.38 38.5,3.38 38.75,3.62 38.75,4.25 JP2.D-
  Bottom 0.203: C13-U.1 31.38,7 31.88,7 v32.38,6.5 33,5.88 v34.38,5.88
PIO5  (via drill 0.3)
  Top 0.203: v35.38,23.38 31.62,23.38 30.75,22.5 30.5,22.5 R8-C1.1
  Bottom 0.203: v35.38,23.38 33.25,23.38 32.38,22.5 32.38,22.12 U1.21
POWER_OFF  (via drill 0.3)
  Top 0.254: R4-PB.2 3.25,22.25 5.5,22.25 R5-PB.2 5.62,22.25 v6.75,23.38 | v10.88,13.25 10.88,17.75 v13,19.88
  Bottom 0.254: v10.88,13.25 10.88,11 9.88,10 9.88,5.88 IC1.32 | v13,19.88 13,20.88 12.75,21.12 10.25,21.12 9,22.38 9,22.88 8.38,23.5 6.75,23.5 | 6.75,23.5 4,23.5 1.38,20.88 1.38,19.25 D1-PB.1 | v6.75,23.38 6.75,23.5
RESET  (via drill 0.3)
  Top 0.203: 18.38,6.62 18.25,6.62 18,6.88 R1-M.2 18.38,6.62 | 18.38,6.62 19.88,6.62 C3-M.2 | 18.38,6.62 v18.38,5.75
  Bottom 0.203: v18.38,5.75 18.5,5.62 18.5,4.12 18.12,3.75 15.88,3.75 15.25,4.38 13.12,4.38 12.25,5.25 12.25,5.75 IC1.29
RESET-B  (via drill 0.3)
  Top 0.203: v7.12,6.12 7.12,3.38 4.62,0.88 2.38,0.88 1.88,1.38 1.88,3.5 0.62,4.75 0.62,12.38 2.25,14 4.62,14 9.38,18.75 11,18.75 13.38,21.12 18.62,21.12 v21.25,18.5
  Bottom 0.203: v7.12,6.12 8.25,7.25 IC1.1 | v21.25,18.5 21.25,15.25 26.5,10 30.5,10 31.12,9.38 31.12,9 U1.5
RXI  (via drill 0.3)
  Top 0.203: v25.88,11.62 25.88,7.38 U3.4 | v22.75,14.62 v17.38,14.62
  Bottom 0.203: 25.88,13.62 25.88,15 23.25,17.62 23.25,21 23.88,21.62 23.88,22 U1.14 | 25.88,13.62 v25.88,11.62 | v17.38,14.62 11.38,8.62 11.38,5.88 IC1.30 | v22.75,14.62 23.75,13.62 25.88,13.62
SCK  (via drill 0.3)
  Top 0.203: v18,14 20.38,14 v21.25,13.12 | v23.5,10.88 23.5,6.12 27,2.62 29.12,2.62 JP1.3
  Bottom 0.203: v18,14 17,13 IC1.17 | v23.5,10.88 v21.25,13.12
TXO  (via drill 0.3)
  Top 0.203: v24,14.25 24,12.75 U3.20 23.88,12.62 22.88,11.62 v22.88,6.75 | v10.62,4.5 10.62,2.75 11.12,2.25 12.88,2.25 13.12,2 v14.12,2
  Bottom 0.203: v24,14.25 24,16.25 22.75,17.5 22.75,22 U1.13 | v10.62,4.5 10.62,5.75 IC1.31 | v14.12,2 14.38,2 14.88,2.5 18.62,2.5 v22.88,6.75
V_IN  (via drill 0.3)
  Top 0.203: R4-PB.1 1.25,22.12 0.5,21.38 0.5,16.12 1.5,15.12 C4-PB.1 1.62,15.12 2.38,15.12 v5.25,18 | v15.5,16.75 15.5,13.5 C10-R.1
  Bottom 0.203: 7.25,17 8.38,17 U$8.5 8.5,17 8.75,17 10.25,18.5 13.88,18.5 15.5,16.88 v15.5,16.75 16.62,17.88 IC2.8 | 7.25,17 U$8.6 7.25,17 | v5.25,18 6.25,18 7.25,17
VBAT  (via drill 0.3)
  Top 0.203: U2.3 38.62,20 38.62,20.25 37.5,21.38 33.25,21.38 32.38,22.25 C9-C.1 32.25,22.25 30.5,20.5 CN2.2 21,20.5 18.62,22.88 9,22.88 8,21.88 R7-PB.1 7.88,21.75 7.75,21.62 v7.75,20.62 7.75,19.62 C6-PB.1
  Bottom 0.203: R6-PB.1 6.38,13.88 4,16.25 4,22.88 4.12,23 6.25,23 7.12,22.12 U$8.3 7.12,21.25 v7.75,20.62
VBUS  (via drill 0.3)
  Top 0.203: U2.4 38.75,22.38 38.75,21.12 39.25,20.62 39.25,18.75 38.5,18 C8-C.1 38.88,17.88 v38.38,16.5 | JP2.VBUS 38.12,4.38 36.75,5.75 36.75,8.38 37.62,9.25 37.62,9.5 LED3-C.A 37.75,9.62
  Top 0.254: v37.38,12.12 37.38,9.62 37.75,9.62
  Bottom 0.203: v37.38,12.12 v38.38,16.5

### Text on the board
tPlace: MISO SCK DTR | VCC MOSI GND | ACC | FLX | O 1 2 X Y Z
bPlace: GND VCC
tNames: MIDI Glove v1.1 | BT | By Allan, Michael & Sarah | ON/OFF